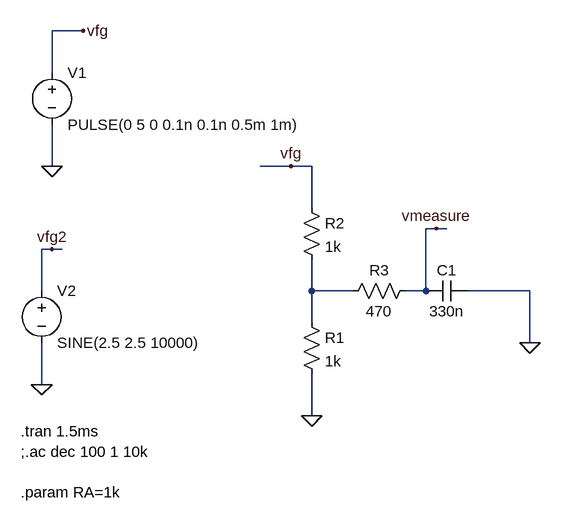
[diagram p0: schematic hardwaretask1.asc]
hardwaretask1.asc, the LTspice schematic file:
Version 4
SHEET 1 880 680
WIRE 0 -256 -48 -256
WIRE -48 -192 -48 -256
WIRE -48 -48 -48 -112
WIRE 320 -48 272 -48
WIRE 352 -48 320 -48
WIRE 352 16 352 -48
WIRE 544 48 528 48
WIRE 560 48 544 48
WIRE -48 80 -64 80
WIRE -32 80 -48 80
WIRE -64 144 -64 80
WIRE 352 144 352 96
WIRE 416 144 352 144
WIRE 528 144 528 48
WIRE 528 144 496 144
WIRE 688 144 592 144
WIRE 352 192 352 144
WIRE 688 224 688 144
WIRE -64 288 -64 224
WIRE 352 336 352 272
FLAG -48 -48 0
FLAG -64 288 0
FLAG 352 336 0
FLAG 688 224 0
FLAG 544 48 vmeasure
FLAG -48 80 vfg2
FLAG 320 -48 vfg
FLAG 0 -256 vfg
SYMBOL voltage -48 -208 R0
WINDOW 123 0 0 Left 0
WINDOW 39 0 0 Left 0
SYMATTR InstName V1
SYMATTR Value PULSE(0 5 0 0.1n 0.1n 0.5m 1m)
SYMBOL voltage -64 128 R0
WINDOW 123 0 0 Left 0
WINDOW 39 0 0 Left 0
SYMATTR InstName V2
SYMATTR Value SINE(2.5 2.5 10000)
SYMBOL res 336 176 R0
SYMATTR InstName R1
SYMATTR Value 1k
SYMBOL res 336 0 R0
SYMATTR InstName R2
SYMATTR Value 1k
SYMBOL res 512 128 R90
WINDOW 0 0 56 VBottom 2
WINDOW 3 32 56 VTop 2
SYMATTR InstName R3
SYMATTR Value 470
SYMBOL cap 592 128 R90
WINDOW 0 0 32 VBottom 2
WINDOW 3 32 32 VTop 2
SYMATTR InstName C1
SYMATTR Value 330n
TEXT -96 360 Left 2 !.tran 1.5ms\n;.ac dec 100 1 10k\n \n.param RA=1k

The netlist it stands for:
* hardwaretask1.asc
V1 vfg 0 PULSE(0 5 0 0.1n 0.1n 0.5m 1m)
V2 vfg2 0 SINE(2.5 2.5 10000)
R1 N001 0 1k
R2 vfg N001 1k
R3 vmeasure N001 470
C1 0 vmeasure 330n
.tran 1.5ms
;.ac dec 100 1 10k
.param RA=1k
.backanno
.end

* Results of the author's LTspice run, read from the files saved beside the schematic
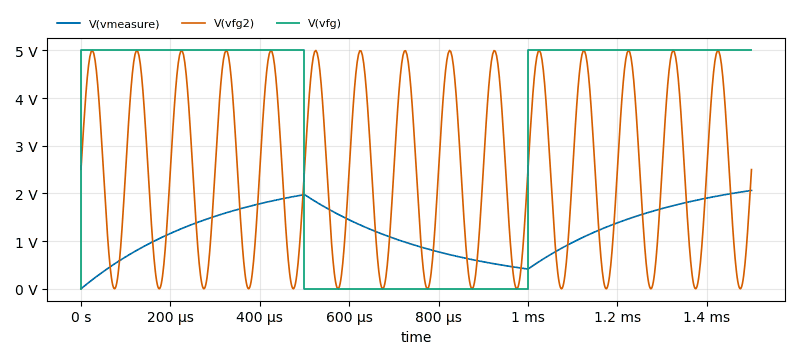
[diagram p1: Transient Analysis of hardwaretask1.asc, plotted from the saved traces]
* Transient Analysis, 1 run:
*   V(vmeasure): min 0 V, max 2.063 V, average 1.226 V, rms 1.334 V, last 2.063 V
*   V(vfg2): min 12.88 µV, max 5 V, average 2.498 V, rms 3.065 V, last 2.5 V
*   V(vfg): min 0 V, max 5 V, average 3.333 V, rms 4.082 V, last 5 V